# EAGLE design arduinoDra818 (EAGLE 6.6.0)
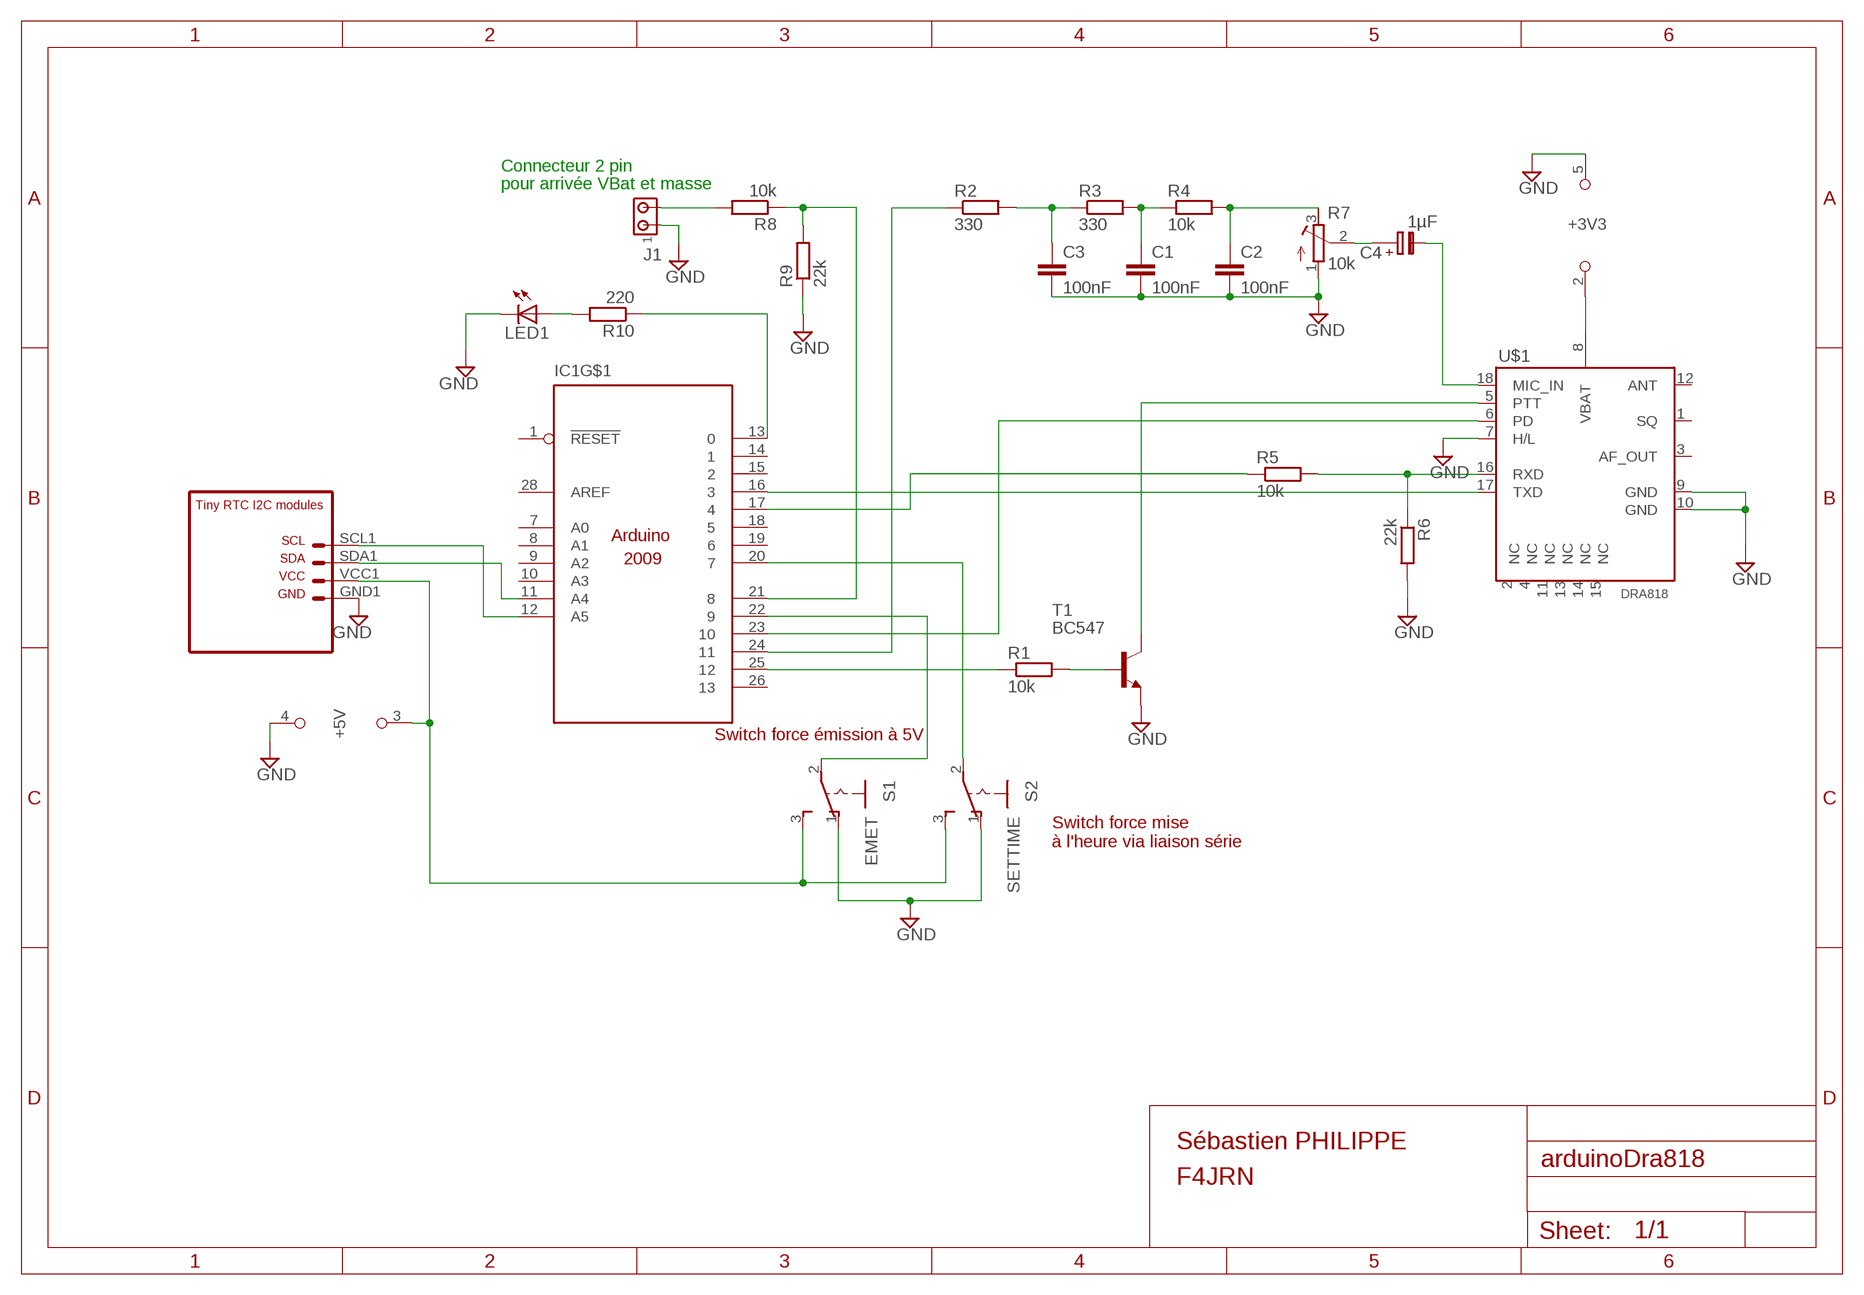
[diagram p0: schematic, sheet 1]

## Parts
C1  100nF  C-EU050-025X075  [C050-025X075]
C2  100nF  C-EU050-025X075  [C050-025X075]
C3  100nF  C-EU050-025X075  [C050-025X075]
C4  1µF  C-PR-2,0X5  [E2,0-5]
IC1  Arduino  ARDUINO2009_21  [ARDUINO2009_1]
J1  MTA02-100  [10X02MTA]
LED1  LED3MM  [LED3MM]
R1  10k  R-EU_0411/15  [0411/15]
R2  330  R-EU_0411/15  [0411/15]
R3  330  R-EU_0411/15  [0411/15]
R4  10k  R-EU_0411/15  [0411/15]
R5  10k  R-EU_0411/15  [0411/15]
R6  22k  R-EU_0411/15  [0411/15]
R7  10k  R-TRIMM3339P  [RTRIM3339P]
R8  10k  R-EU_0411/15  [0411/15]
R9  22k  R-EU_0411/15  [0411/15]
R10  220  R-EU_0411/15  [0411/15]
S1  EMET  255SB  [255SB]
S2  SETTIME  255SB  [255SB]
T1  BC547  [TO92]
U$1  DRA818  DRA818A  [DRA818A]
U$2  RTC  [RTC]

## Nets
+5V: IC1.3(+5V) S1.3(S) S2.3(S) U$2.VCC1
GND: C1.2 C2.2 C3.2 IC1.4(GND) IC1.5(GND) J1.1 LED1.K(C) R6.2 R7.1(E) R9.1 S1.1(O) S2.1(O) T1.1(E) U$1.7(H/L) U$1.9(GND) U$1.10(GND) U$2.GND1
N$1: IC1.25 R1.1
N$2: R1.2 T1.2(B)
N$3: IC1.24 R2.1
N$4: IC1.17 R5.1
N$5: IC1.12(A5) U$2.SCL1
N$6: IC1.11(A4) U$2.SDA1
N$7: IC1.2(+3V3) U$1.8(VBAT)
N$8: C4.- U$1.18(MIC_IN)
N$9: T1.3(C) U$1.5(PTT)
N$10: IC1.16 U$1.17(TXD)
N$11: C3.1 R2.2 R3.1
N$12: R5.2 R6.1 U$1.16(RXD)
N$13: J1.2 R8.2
N$14: C1.1 R3.2 R4.1
N$15: C2.1 R4.2 R7.3(A)
N$16: C4.+ R7.2(S)
N$17: IC1.23 U$1.6(PD)
N$18: IC1.21 R8.1 R9.2
N$19: IC1.22 S1.2(P)
N$20: IC1.20 S2.2(P)
N$21: IC1.13 R10.1
N$22: LED1.A R10.2
Unconnected: IC1.1(!RESET) IC1.7(A0) IC1.8(A1) IC1.9(A2) IC1.10(A3) IC1.14 IC1.15 IC1.18 IC1.19 IC1.26 IC1.28(AREF) U$1.1(SQ) U$1.2(NC) U$1.3(AF_OUT) U$1.4(NC) U$1.11(NC) U$1.12(ANT) U$1.13(NC) U$1.14(NC) U$1.15(NC)

## Notes on the sheet
- Connecteur 2 pin
- pour arrivée VBat et masse
- Switch force émission à 5V
- Switch force mise
  à l'heure via liaison série
- Sébastien PHILIPPE
- F4JRN

## Power pins joined to a net without a drawn wire
+VIN: IC1.6(+VIN)
GND: IC1.27(GND)

## Library data of the parts
C1-C3 = resistor:C-EU: CAPACITOR, European symbol
C4 = cap-pan40:C-PR: POLARIZED ELECTROLYTIC/TANTALUM
IC1 = arduino:ARDUINO2009_2: The Arduino Duemilanove ("2009") is a microcontroller board based on the ATmega168 or ATmega328. - 14 digital input/output pins (of which 6 can be used as PWM outputs) - 6 analog inputs, a 16 MHz crystal oscillator - USB connection - power jack - ISP header - reset button It contains everything needed to support the microcontroller; simply connect it to a computer with a USB cable or power it with a AC-to-DC adapter or battery to get started http://arduino.cc/en/Main/ArduinoBoardDuemilanove
J1 = con-amp:MTA02-100: AMP connector
LED1 = led:LED: LED OSRAM: - CHIPLED LG R971, LG N971, LY N971, LG Q971, LY Q971, LO R971, LY R971 LH N974, LH R974 LS Q976, LO Q976, LY Q976 LO Q996 - Hyper CHIPLED LW Q18S LB Q993, LB Q99A, LB R99A - SideLED LS A670, LO A670, LY A670, LG A670, LP A670 LB A673, LV A673, LT A673, LW A673 LH A674 LY A675 LS A676, LA A676, LO A676, LY A676, LW A676 LS A679, LY A679, LG A679 - Hyper Micro SIDELED® LS Y876, LA Y876, LO Y876, LY Y876 LT Y87S - SmartLED LW L88C, LW L88S LB L89C, LB L89S, LG L890 LS L89K, LO L89K, LY L89K LS L896, LA L896, LO L896, LY L896 - TOPLED LS T670, LO T670, LY T670, LG T670, LP T670 LSG T670, LSP T670, LSY T670, LOP T670, LYG T670 LG T671, LOG T671, LSG T671 LB T673, LV T673, LT T673, LW T673 LH T674 LS T676, LA T676, LO T676, LY T676, LB T676, LH T676, LSB T676, LW T676 LB T67C, LV T67C, LT T67C, LS T67K, LO T67K, LY T67K, LW E67C LS E67B, LA E67B, LO E67B, LY E67B, LB E67C, LV E67C, LT E67C LW T67C LS T679, LY T679, LG T679 LS T770, LO T770, LY T770, LG T770, LP T770 LB T773, LV T773, LT T773, LW T773 LH T774 LS E675, LA E675, LY E675, LS T675 LS T776, LA T776, LO T776, LY T776, LB T776 LHGB T686 LT T68C, LB T68C - Hyper Mini TOPLED® LB M676 - Mini TOPLED Santana® LG M470 LS M47K, LO M47K, LY M47K Source: http://www.osram.convergy.de LUXEON: - LUMILED® LXK2-PW12-R00, LXK2-PW12-S00, LXK2-PW14-U00, LXK2-PW14-V00 LXK2-PM12-R00, LXK2-PM12-S00, LXK2-PM14-U00 LXK2-PE12-Q00, LXK2-PE12-R00, LXK2-PE12-S00, LXK2-PE14-T00, LXK2-PE14-U00 LXK2-PB12-K00, LXK2-PB12-L00, LXK2-PB12-M00, LXK2-PB14-N00, LXK2-PB14-P00, LXK2-PB14-Q00 LXK2-PR12-L00, LXK2-PR12-M00, LXK2-PR14-Q00, LXK2-PR14-R00 LXK2-PD12-Q00, LXK2-PD12-R00, LXK2-PD12-S00 LXK2-PH12-R00, LXK2-PH12-S00 LXK2-PL12-P00, LXK2-PL12-Q00, LXK2-PL12-R00 Source: www.luxeon.com KINGBRIGHT: KA-3528ASYC Source: www.kingbright.com
R1-R6 R8-R10 = resistor:R-EU_: RESISTOR, European symbol
R7 = resistor:R-TRIMM: Trimm resistor
S1 S2 = switch:255SB: SLIDING SWITCH Distributor Buerklin, 11G810
T1 = transistor:BC547: NPN TRANSISTOR
U$1 = dra818:DRA818A
U$2 = ds3231:RTC

## Board
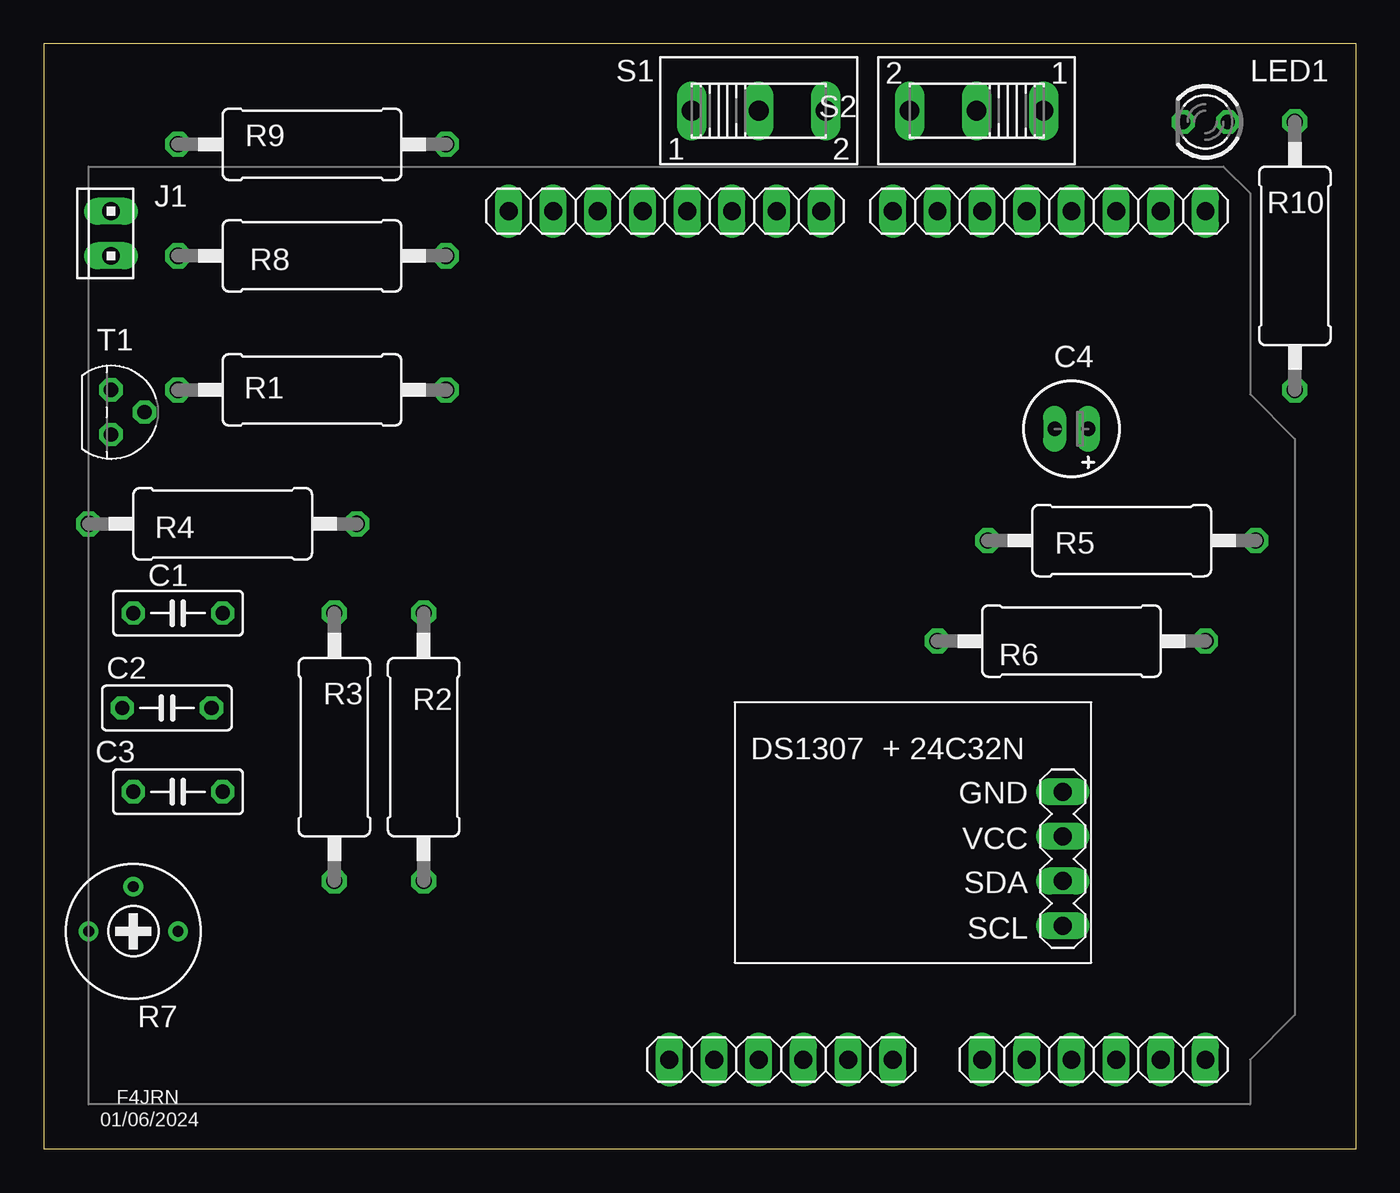
[diagram p1: board, top side]
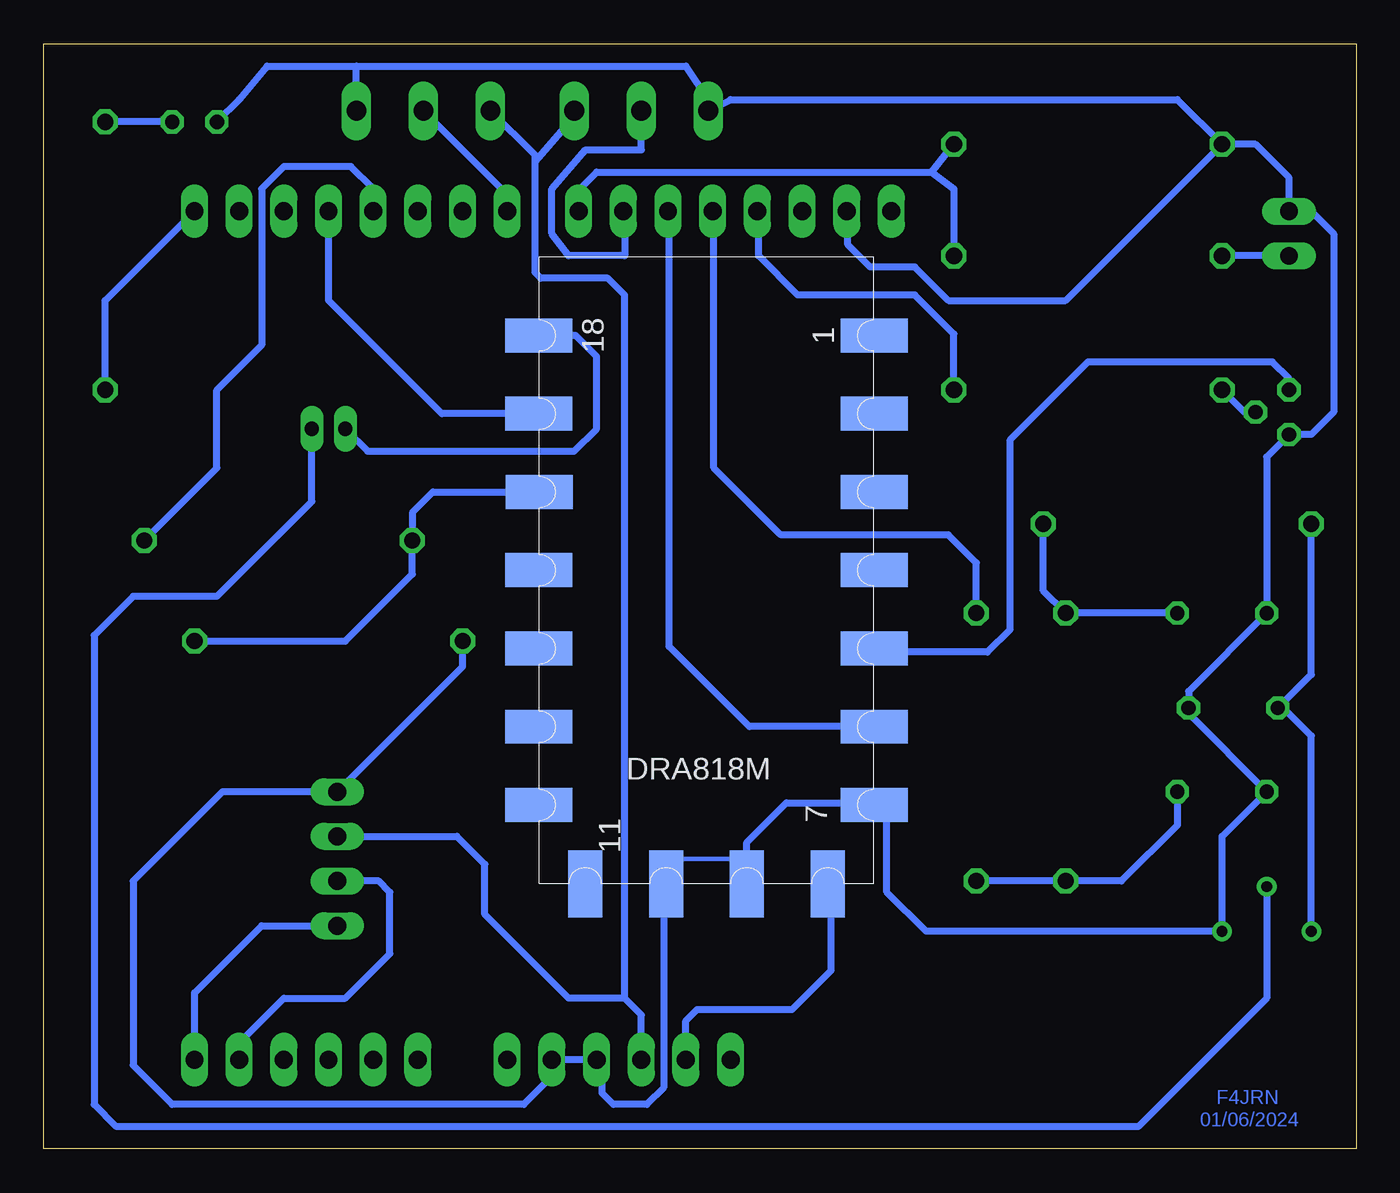
[diagram p2: board, bottom side, seen from below]

Size 74.6 x 62.85 mm. Coordinates in mm from the lower left corner, seen from the top.
Outline: 0,0 74.6,0 74.6,62.85 0,62.85 0,0
Copper layers (1*16): Top 0.035mm / dielectric 1.5mm / Bottom 0.035mm
Design rules "default": minimum track width 10mil, minimum drill 24mil, track to track 8mil, track to pad 8mil, pad to pad 8mil, via to via 8mil, smd to smd 8mil, copper to edge 40mil, drill to drill 8mil, minimum pad ring 10mil, minimum via ring 8mil, stop-mask expansion 4mil, vias tented up to drill 0mil, thermal gap 10mil

### Footprints (pad centres in the part's own frame; a part is rotated, then mirrored left to right if it is on the bottom)
C050-025X075 = drill 0.813 octagon: 1 -2.54,0; 2 2.54,0
E2,0-5 = drill 0.813 long: + -0.953,0; - 0.953,0
ARDUINO2009_1 = drill 1.016 long: 1 33.02,2.54; 2 35.56,2.54; 3 38.1,2.54; 4 40.64,2.54; 5 43.18,2.54; 6 45.72,2.54; 7 50.8,2.54; 8 53.34,2.54; 9 55.88,2.54; 10 58.42,2.54; 11 60.96,2.54; 12 63.5,2.54; 13 63.5,50.8; 14 60.96,50.8; 15 58.42,50.8; 16 55.88,50.8; 17 53.34,50.8; 18 50.8,50.8; 19 48.26,50.8; 20 45.72,50.8; 21 41.656,50.8; 22 39.116,50.8; 23 36.576,50.8; 24 34.036,50.8; 25 31.496,50.8; 26 28.956,50.8; 27 26.416,50.8; 28 23.876,50.8
10X02MTA = drill 1.016 long: 1 1.27,0; 2 -1.27,0
LED3MM = drill 0.813 octagon: A -1.27,0; K 1.27,0
0411/15 = drill 0.914 octagon: 1 -7.62,0; 2 7.62,0
RTRIM3339P = drill 0.61: 1 -2.54,0; 2 0,-2.54; 3 2.54,0
255SB = drill 1.118 long: 1 -3.81,0; 2 0,0; 3 3.81,0
TO92 = drill 0.813 octagon: 1 1.27,0; 2 0,1.905; 3 -1.27,0
DRA818A = smd 3.81 x 1.93: 1 -9.45,-13.25; 2 -9.45,-8.8; 3 -9.45,-4.35; 4 -9.45,0.1; 5 -9.45,4.55; 6 -9.45,9; 7 -9.45,13.45; 12 9.65,13.45; 13 9.65,9; 14 9.65,4.55; 15 9.65,0.1; 16 9.6,-4.35; 17 9.65,-8.8; 18 9.65,-13.25 | smd 1.93 x 3.81: 8 -6.8,17.95; 9 -2.2,17.95; 10 2.4,17.95; 11 7,17.95
RTC = drill 1.016 long: GND1 1.765,5.08; SCL1 1.765,12.7; SDA1 1.765,10.16; VCC1 1.765,7.62

### Placement (x,y rotation side)
C1  7.62,30.48 180 top
C2  6.99,25.08 0 top
C3  7.62,20.32 180 top
C4  58.42,40.96 180 top
IC1  2.54,2.54 0 top
J1  3.81,52.07 90 top
LED1  66.04,58.42 180 top
R1  15.24,43.18 180 top
R2  21.59,22.86 270 top
R3  16.51,22.86 90 top
R4  10.16,35.56 180 top
R5  61.28,34.61 180 top
R6  58.42,28.89 180 top
R7  5.08,12.38 180 top
R8  15.24,50.8 180 top
R9  15.24,57.15 0 top
R10  71.12,50.8 90 top
S1  40.64,59.05 0 top
S2  53.02,59.05 180 top
T1  3.81,41.91 270 top
U$1  36.83,33.02 180 bottom
U$2  59.69,25.4 180 top

### Tracks (layer width: path | path; a pad name or v marks a point on that pad's centre or on a via)
+5V
  Bottom 0.406: 46.67,56.2 46.67,49.85 46.35,49.53 42.55,49.53 41.59,48.58 41.59,8.57 | 46.67,56.2 44.45,58.74 S1.3 | IC1.3 40.64,7.62 41.59,8.57 | U$2.VCC1 51.12,17.78 49.53,16.19 49.53,13.34 44.77,8.57 41.59,8.57 | 46.67,56.2 46.67,56.52 S2.3
GND
  Bottom 0.254: U$1.9 35.56,16.51 39.37,16.51 U$1.10 39.37,15.24
  Bottom 0.406: 56.83,61.59 61.91,61.59 63.5,59.69 LED1.K | 56.83,61.59 38.1,61.59 36.83,59.69 S1.1 35.56,59.69 10.16,59.69 R9.1 | R9.1 16.51,48.26 23.18,48.26 25.08,50.16 27.62,50.16 28.89,51.44 28.89,53.28 IC1.27 | R9.1 5.71,57.15 3.81,55.24 J1.1 2.54,53.34 1.27,52.07 1.27,41.91 2.54,40.64 T1.1 5.08,39.37 C1.2 9.53,26.04 C2.2 9.53,24.77 C3.2 7.62,17.78 R7.1 24.45,12.38 26.67,14.61 26.67,18.86 U$1.7 27.49,19.68 32.38,19.68 34.63,17.44 U$1.9 | 39.37,16.51 39.37,3.49 40.32,2.54 42.23,2.54 42.86,3.17 42.86,4.76 IC1.4 IC1.5 45.72,4.13 47.31,2.54 67.31,2.54 69.53,4.76 69.53,15.24 64.45,20.32 U$2.GND1 50.8,27.45 R6.2 | S2.1 56.83,61.59
N$1
  Bottom 0.406: R1.1 22.86,46.35 25.08,48.58 31.75,48.58 33.97,50.8 33.97,53.28 IC1.25
N$2
  Bottom 0.406: T1.2 6.35,41.91 R1.2
N$3
  Bottom 0.406: R2.1 21.59,33.34 23.18,34.92 32.7,34.92 36.51,38.73 36.51,53.28 IC1.24
N$4
  Bottom 0.406: IC1.17 55.88,54.61 57.15,55.88 60.96,55.88 62.23,54.61 62.23,45.72 64.77,43.18 64.77,38.73 R5.1
N$5
  Bottom 0.406: IC1.12 66.04,8.89 62.23,12.7 U$2.SCL1
N$6
  Bottom 0.406: IC1.11 63.5,6.03 60.96,8.57 57.47,8.57 54.93,11.11 54.93,14.61 55.56,15.24 U$2.SDA1
N$7
  Bottom 0.406: IC1.2 38.1,7.3 37.46,7.94 32.07,7.94 29.84,10.16 29.84,16.16 U$1.8
N$8
  Bottom 0.406: C4.- 56.2,39.69 44.45,39.69 43.18,40.96 43.18,45.09 44.37,46.27 U$1.18
N$9
  Bottom 0.406: T1.3 3.81,43.81 4.76,44.77 15.24,44.77 19.68,40.32 19.68,29.53 20.95,28.26 27.17,28.26 U$1.5
N$10
  Bottom 0.406: IC1.16 58.42,48.26 51.98,41.82 U$1.17
N$11
  Bottom 0.406: C3.1 10.16,18.41 13.34,15.24 R3.1 R2.2
N$12
  Bottom 0.406: R6.1 57.47,28.89 53.66,32.7 R5.2 53.66,36.2 52.48,37.37 U$1.16
N$13
  Bottom 0.406: J1.2 R8.2
N$14
  Bottom 0.406: C1.1 R3.2 17.78,31.75 R4.1
N$15
  Bottom 0.406: R7.3 2.54,23.49 4.13,25.08 C2.1 2.54,26.99 R4.2
N$16
  Bottom 0.406: R7.2 5.08,8.57 12.38,1.27 70.48,1.27 71.76,2.54 71.76,29.21 69.53,31.43 64.77,31.43 59.37,36.83 C4.+
N$17
  Bottom 0.406: IC1.23 39.05,53.28 39.05,28.57 34.5,24.02 U$1.6
N$18
  Bottom 0.406: IC1.21 44.2,54.55 43.18,55.56 24.13,55.56 | 24.13,55.56 R9.2 | 24.13,55.56 22.86,54.61 R8.1
N$19
  Bottom 0.406: IC1.22 41.59,53.34 41.59,50.8 44.77,50.8 45.72,52.07 45.72,54.61 43.81,56.83 40.64,56.83 S1.2
N$20
  Bottom 0.406: IC1.20 48.26,54.29 S2.2
N$21
  Bottom 0.406: R10.1 71.12,48.26 IC1.13
N$22
  Bottom 0.406: LED1.A R10.2

### Text on the board
Bottom: F4JRN | 01/06/2024
tPlace: F4JRN | 01/06/2024